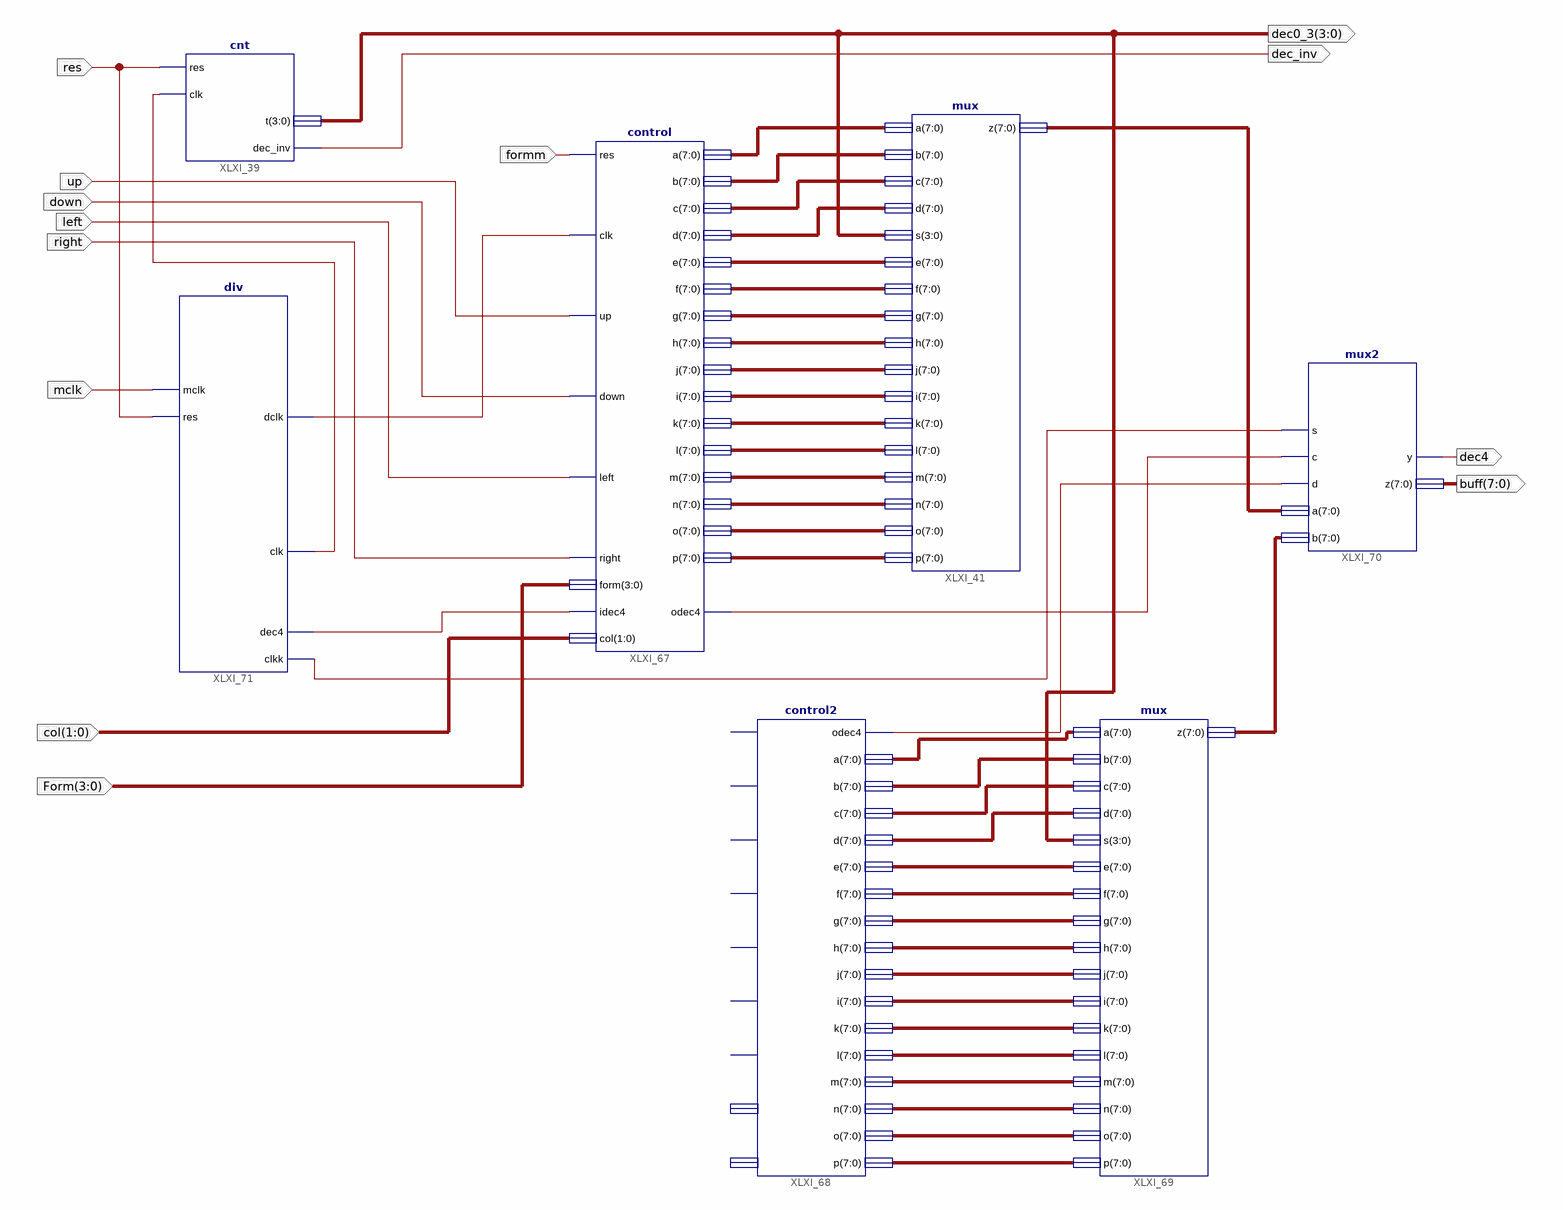
[diagram p0: schematic sheet 1]
// Xilinx ISE schematic top.sch (spartan3e) as structural Verilog: 7 symbols, 13 ports
module top (
  input  mclk,
  input  down,
  input  left,
  input  up,
  input  right,
  input  res,
  input  formm,
  input  [1:0] col,
  input  [3:0] Form,
  output [3:0] dec0_3,
  output dec_inv,
  output dec4,
  output [7:0] buff
);

  wire XLXN_175, XLXN_263, XLXN_295, XLXN_296, XLXN_297, XLXN_300;
  wire [7:0] XLXN_246, XLXN_247, XLXN_248, XLXN_249, XLXN_250, XLXN_251, XLXN_252, XLXN_253, XLXN_254,
       XLXN_255, XLXN_256, XLXN_257, XLXN_258, XLXN_259, XLXN_260, XLXN_261, XLXN_271, XLXN_272, XLXN_273,
       XLXN_274, XLXN_275, XLXN_276, XLXN_277, XLXN_278, XLXN_279, XLXN_280, XLXN_281, XLXN_282, XLXN_286,
       XLXN_287, XLXN_288, XLXN_289, XLXN_298, XLXN_299;

  mux XLXI_41 (
    .a(XLXN_246), .b(XLXN_247), .c(XLXN_248), .d(XLXN_249), .e(XLXN_250), .f(XLXN_251), .g(XLXN_252),
    .h(XLXN_253), .j(XLXN_254), .i(XLXN_255), .k(XLXN_256), .l(XLXN_257), .m(XLXN_258), .n(XLXN_259),
    .o(XLXN_260), .p(XLXN_261), .s(dec0_3), .z(XLXN_299));
  cnt XLXI_39 (.res(res), .clk(XLXN_175), .dec_inv(dec_inv), .t(dec0_3));
  control XLXI_67 (
    .res(formm), .clk(XLXN_300), .up(up), .down(down), .left(left), .right(right), .form(Form), .a(XLXN_246),
    .b(XLXN_247), .c(XLXN_248), .d(XLXN_249), .e(XLXN_250), .f(XLXN_251), .g(XLXN_252), .h(XLXN_253),
    .j(XLXN_254), .i(XLXN_255), .k(XLXN_256), .l(XLXN_257), .m(XLXN_258), .n(XLXN_259), .o(XLXN_260),
    .p(XLXN_261), .idec4(XLXN_263), .col(col), .odec4(XLXN_295));
  control2 XLXI_68 (
    .odec4(XLXN_296), .a(XLXN_289), .b(XLXN_288), .c(XLXN_287), .d(XLXN_286), .e(XLXN_282), .f(XLXN_281),
    .g(XLXN_280), .h(XLXN_279), .j(XLXN_278), .i(XLXN_277), .k(XLXN_276), .l(XLXN_275), .m(XLXN_274),
    .n(XLXN_273), .o(XLXN_272), .p(XLXN_271));  // open: res, clk, up, down, left, right, idec4, form, col
  mux XLXI_69 (
    .a(XLXN_289), .b(XLXN_288), .c(XLXN_287), .d(XLXN_286), .e(XLXN_282), .f(XLXN_281), .g(XLXN_280),
    .h(XLXN_279), .j(XLXN_278), .i(XLXN_277), .k(XLXN_276), .l(XLXN_275), .m(XLXN_274), .n(XLXN_273),
    .o(XLXN_272), .p(XLXN_271), .s(dec0_3), .z(XLXN_298));
  mux2 XLXI_70 (.s(XLXN_297), .c(XLXN_295), .d(XLXN_296), .a(XLXN_299), .b(XLXN_298), .y(dec4), .z(buff));
  div XLXI_71 (.res(res), .mclk(mclk), .dclk(XLXN_300), .dec4(XLXN_263), .clkk(XLXN_297), .clk(XLXN_175));
endmodule
